# Altium schematic sheet PMIC_3V3AUX_PWR-DEF.SchDoc: 3.3V Auxiliary Power Supply and Power Net Class Definitions
size B; CheckedBy: Jason Sullins; Author: Jordan Harris-Toovy; Revision: 0.2; SheetNumber: 15; SheetTotal: 22; Size: ANSI B
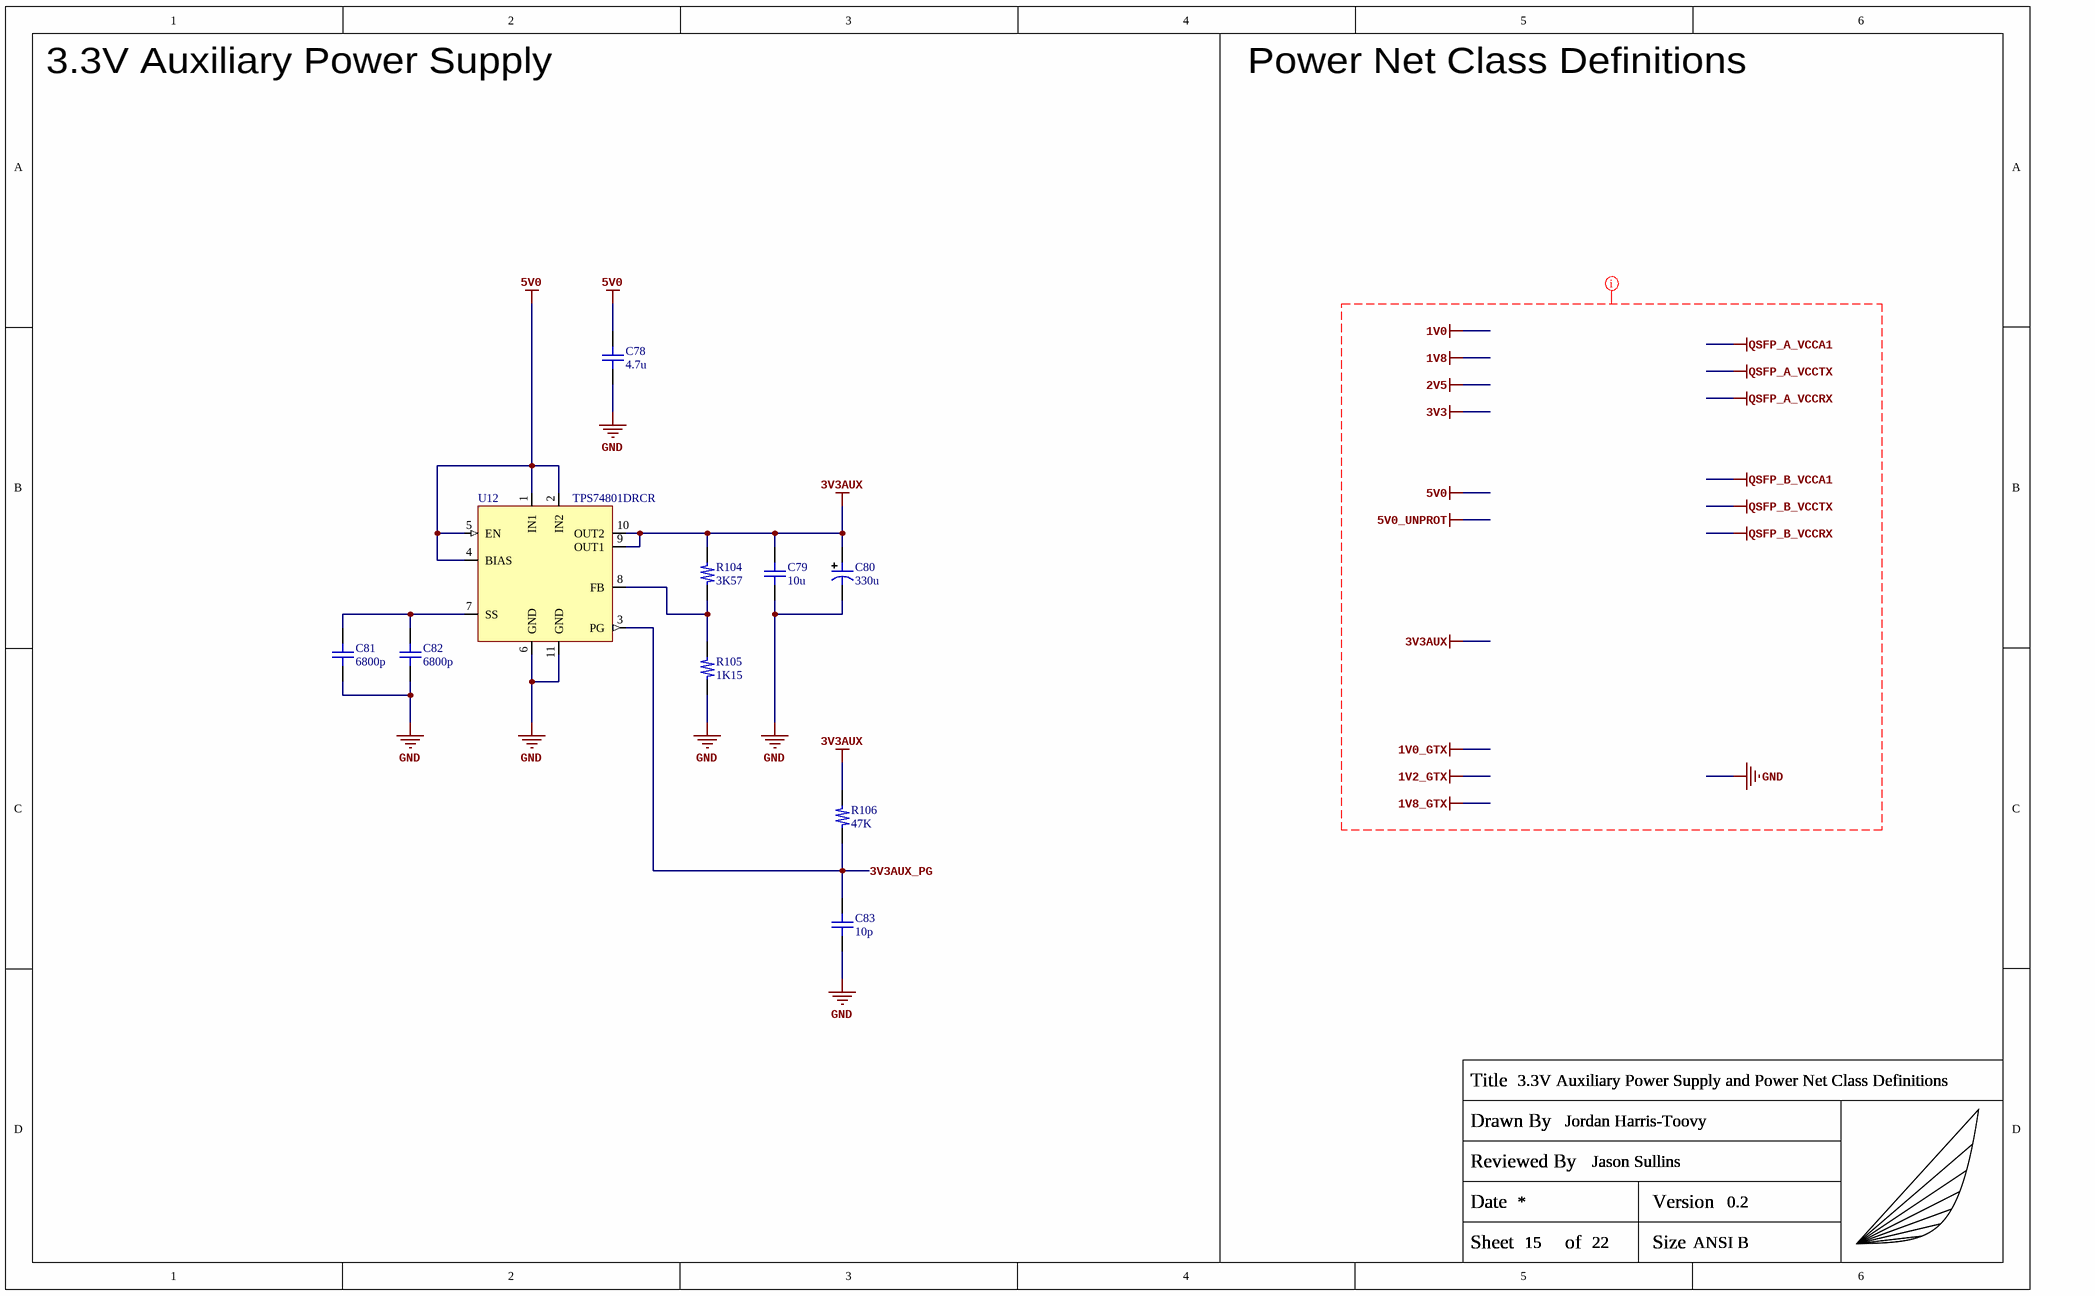
[diagram p0: PMIC_3V3AUX_PWR-DEF.SchDoc]

## Parts
C78  4.7u  [C_0402_Generic]
C79  10u  [C_0402_Generic]
C80  330u  [KEMET_EK_Radial]
C81  6800p  [C_0402_Generic]
C82  6800p  [C_0402_Generic]
C83  10p  [C_0402_Generic]
R104  3K57  [R_0402_Generic]
R105  1K15  [R_0402_Generic]
R106  47K  [R_0402_Generic]
TITLEBLOCK?  Capstone_Title_Block  (value not drawn)  (graphical)
U12  TPS74801DRCR  [TI_10VSON_DRC0010J_ADDVIA]

## Nets
3V3AUX: C79.2 C80.1 R104.2 R106.2 U12.9(OUT1) U12.10(OUT2)
5V0: C78.2 U12.1(IN1) U12.2(IN2) U12.4(BIAS) U12.5(EN)
GND: C78.1 C79.1 C80.2 C81.1 C82.1 C83.1 R105.1 U12.6(GND) U12.11(GND)
3V3AUX_PG: C83.2 R106.1 U12.3(PG)
NetC81_2: C81.2 C82.2 U12.7(SS)
NetR104_1: R104.1 R105.2 U12.8(FB)

## Layout directives
net class POWER: 1V0, 1V0_GTX, 1V2_GTX, 1V8, 1V8_GTX, 2V5, 3V3, 3V3AUX, 5V0, 5V0_UNPROT, GND, QSFP_A_VCCA1, QSFP_A_VCCRX, QSFP_A_VCCTX, QSFP_B_VCCA1, QSFP_B_VCCRX, QSFP_B_VCCTX

## Notes on the sheet
- 3.3V Auxiliary Power Supply
- Power Net Class Definitions
- (in symbol Capstone_Title_Block) Title; Drawn By; Reviewed By; Date; Version; Sheet; of; Size

## Library data of the parts
C78 = GRM155R61A475MEAAJ: 4.7µF 10V X5R SMD ceramic capacitor in 0402 size; Manufacturer: Murata Electronics; Manufacturer Part Number: GRM155R61A475MEAAJ
C79 = CC0402MRX5R6BB106: 10µF 10V X5R SMD ceramic capacitor in 0402 size; Manufacturer: YAGEO; Manufacturer Part Number: CC0402MRX5R6BB106
C80 = A759EK337M1AAAE018: 330µF 10V Aluminum polymer capacitor, KEMET EK; Manufacturer: KEMET; Manufacturer Part Number: A759EK337M1AAAE018
C81 C82 = GRM155R71E682KA01D: 6800pF 25V X7R SMD ceramic capacitor in 0402 size; Manufacturer: Murata Electronics; Manufacturer Part Number: GRM155R71E682KA01D
C83 = GRM1555C1H100JA01D: 10pF 50V C0G/NP0 SMD ceramic capacitor in 0402 size; Manufacturer: Murata Electronics; Manufacturer Part Number: GRM1555C1H100JA01D
R104 = ERJ-2RKF3571X: 3.57KOhm 1% 1/10W SMD resistor in 0402 size; Manufacturer: Panasonic; Manufacturer Part Number: ERJ-2RKF3571X
R105 = ERJ-2RKF1151X: 1.15KOhm 1% 1/10W SMD resistor in 0402 size; Manufacturer: Panasonic; Manufacturer Part Number: ERJ-2RKF1151X
R106 = ERJ-2RKF4702X: 47KOhm 1% 1/10W SMD resistor in 0402 size; Manufacturer: Panasonic; Manufacturer Part Number: ERJ-2RKF4702X
TITLEBLOCK? = Capstone_Title_Block: Custom title block with personal logo; Manufacturer: NONE; Manufacturer Part Number: NONE
U12 = TPS74801DRCR: LDO 1.5A 10-VSON; Manufacturer: Texas Instruments; Manufacturer Part Number: TPS74801DRCR